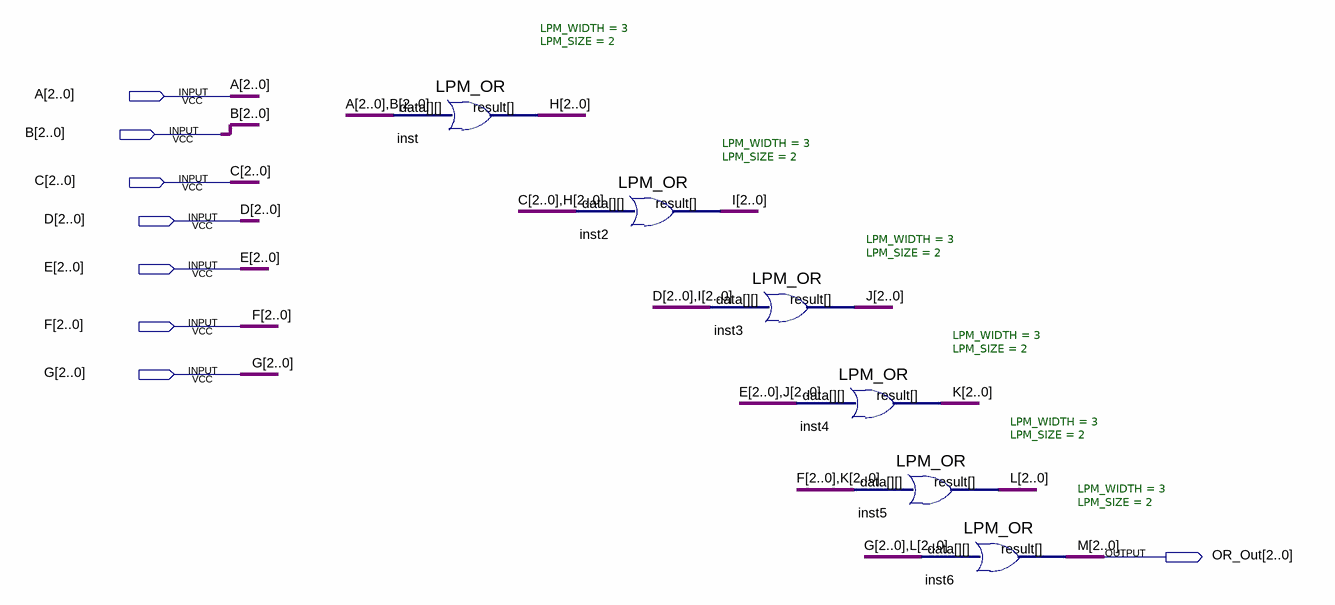
[diagram p0: schematic sheet]
// Quartus schematic 7_IN_OR_GATE.bdf as structural Verilog: 6 symbols, 8 pins
module \7_IN_OR_GATE  (
  input  [2:0] A,
  input  [2:0] B,
  input  [2:0] C,
  input  [2:0] D,
  input  [2:0] E,
  input  [2:0] F,
  input  [2:0] G,
  output [2:0] OR_Out
);

  wire [2:0] H, I, J, K, L;

  LPM_OR #(.LPM_WIDTH(3), .LPM_SIZE(2)) inst (.data({A, B}), .result(H));
  LPM_OR #(.LPM_WIDTH(3), .LPM_SIZE(2)) inst2 (.data({C, H}), .result(I));
  LPM_OR #(.LPM_WIDTH(3), .LPM_SIZE(2)) inst3 (.data({D, I}), .result(J));
  LPM_OR #(.LPM_WIDTH(3), .LPM_SIZE(2)) inst4 (.data({E, J}), .result(K));
  LPM_OR #(.LPM_WIDTH(3), .LPM_SIZE(2)) inst5 (.data({F, K}), .result(L));
  LPM_OR #(.LPM_WIDTH(3), .LPM_SIZE(2)) inst6 (.data({G, L}), .result(OR_Out));

  // Other names for the same wires on the sheet: M[2:0] = OR_Out
endmodule
